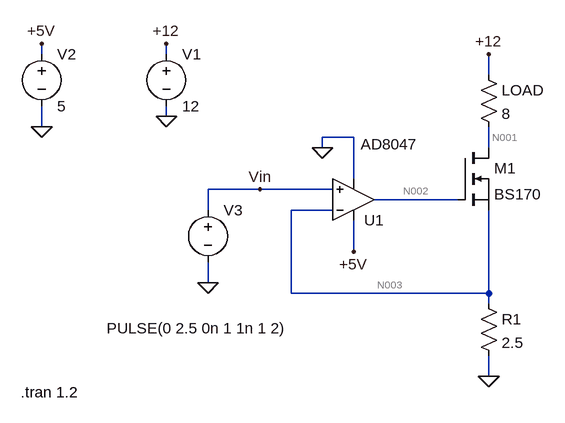
[diagram p0: schematic Draft4.asc]
Draft4.asc, the LTspice schematic file:
Version 4.1
SHEET 1 1232 680
WIRE -160 -80 -160 -96
WIRE 32 -80 32 -96
WIRE 528 -48 528 -80
WIRE 32 16 32 0
WIRE -160 32 -160 0
WIRE 320 48 272 48
WIRE 272 64 272 48
WIRE 528 64 528 32
WIRE 320 112 320 48
WIRE 176 128 96 128
WIRE 288 128 176 128
WIRE 480 144 352 144
WIRE 96 160 96 128
WIRE 288 160 224 160
WIRE 320 224 320 176
WIRE 96 272 96 240
WIRE 224 288 224 160
WIRE 528 288 528 160
WIRE 528 288 224 288
WIRE 528 304 528 288
WIRE 528 416 528 384
FLAG 528 416 0
FLAG 32 16 0
FLAG 32 -96 +12
FLAG -160 32 0
FLAG -160 -96 +5V
FLAG 320 224 +5V
FLAG 272 64 0
FLAG 528 -80 +12
FLAG 96 272 0
FLAG 176 128 Vin
SYMBOL OpAmps\\AD8047 320 208 M180
WINDOW 3 11 149 Left 2
SYMATTR InstName U1
SYMBOL res 512 288 R0
SYMATTR InstName R1
SYMATTR Value 2.5
SYMBOL voltage 32 -96 R0
WINDOW 123 0 0 Left 0
WINDOW 39 0 0 Left 0
SYMATTR InstName V1
SYMATTR Value 12
SYMBOL voltage -160 -96 R0
WINDOW 123 0 0 Left 0
WINDOW 39 0 0 Left 0
SYMATTR InstName V2
SYMATTR Value 5
SYMBOL voltage 96 144 R0
WINDOW 3 -156 198 Left 2
WINDOW 123 0 0 Left 0
WINDOW 39 0 0 Left 0
SYMATTR Value PULSE(0 2.5 0n 1 1n 1 2)
SYMATTR InstName V3
SYMBOL nmos 480 64 R0
SYMATTR InstName M1
SYMATTR Value BS170
SYMBOL res 512 -64 R0
SYMATTR InstName LOAD
SYMATTR Value 8
TEXT -192 440 Left 2 !.tran 1.2

The netlist it stands for:
* Draft4.asc
X§U1 Vin N003 +5V 0 N002 AD8047  ; pins In+ In- V+ V- OUT
R1 N003 0 2.5
V1 +12 0 12
V2 +5V 0 5
V3 Vin 0 PULSE(0 2.5 0n 1 1n 1 2)
M1 N001 N002 N003 N003 BS170
R§LOAD +12 N001 8
.model NMOS NMOS
.model PMOS PMOS
.lib standard.mos
.tran 1.2
.backanno
.end

* Results of the author's LTspice run, read from the files saved beside the schematic
* Operating Point, zero values left out:
*   V(n003) = 1.209 mV
*   V(n002) = 2.237 V
*   V(+12) = 12 V
*   V(+5v) = 5 V
*   V(n001) = 12 V
*   I(R1) = 483.5 µA
*   I(V3) = 2.002 µA
*   I(LOAD) = 487.5 µA
*   I(V1) = -487.5 µA
*   Id(M1) = 487.5 µA
*   Is(M1) = -487.5 µA
*   Ib(M1) = -12 pA
*   I(V2) = -4.998 mA
*   Ix(u1:3) = -2.002 µA
*   Ix(u1:1) = 3.998 µA
*   Ix(u1:99) = 4.998 mA
*   Ix(u1:50) = -5 mA
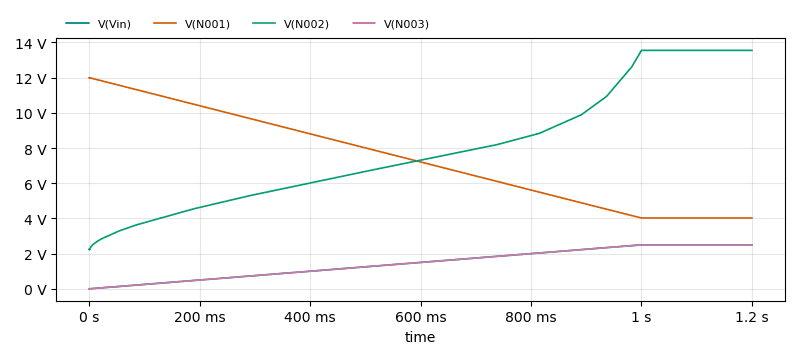
[diagram p1: Transient Analysis of Draft4.asc, plotted from the saved traces]
* Transient Analysis, 1 run:
*   V(Vin): min 0 V, max 2.5 V, average 1.458 V, rms 1.673 V, last 2.5 V
*   V(N001): min 4.025 V, max 12 V, average 7.344 V, rms 7.797 V, last 4.025 V
*   V(N002): min 2.237 V, max 13.55 V, average 7.943 V, rms 8.627 V, last 13.55 V
*   V(N003): min 1.209 mV, max 2.492 V, average 1.455 V, rms 1.669 V, last 2.492 V